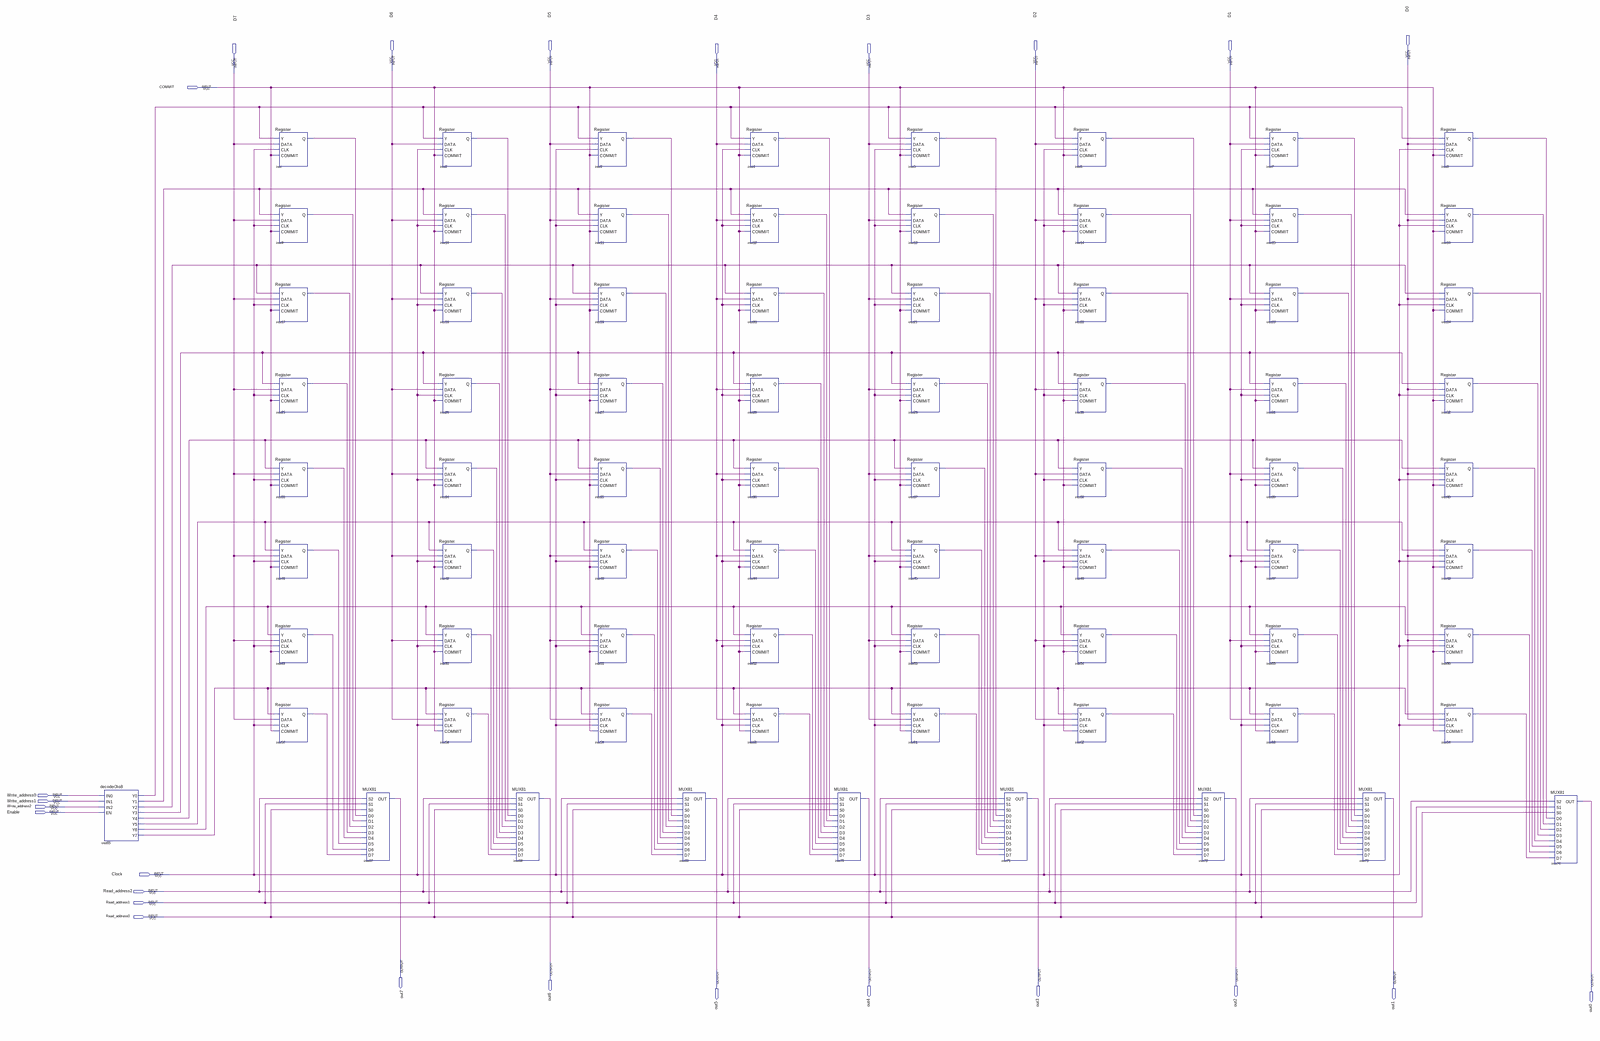
[diagram p0: schematic sheet, whole]
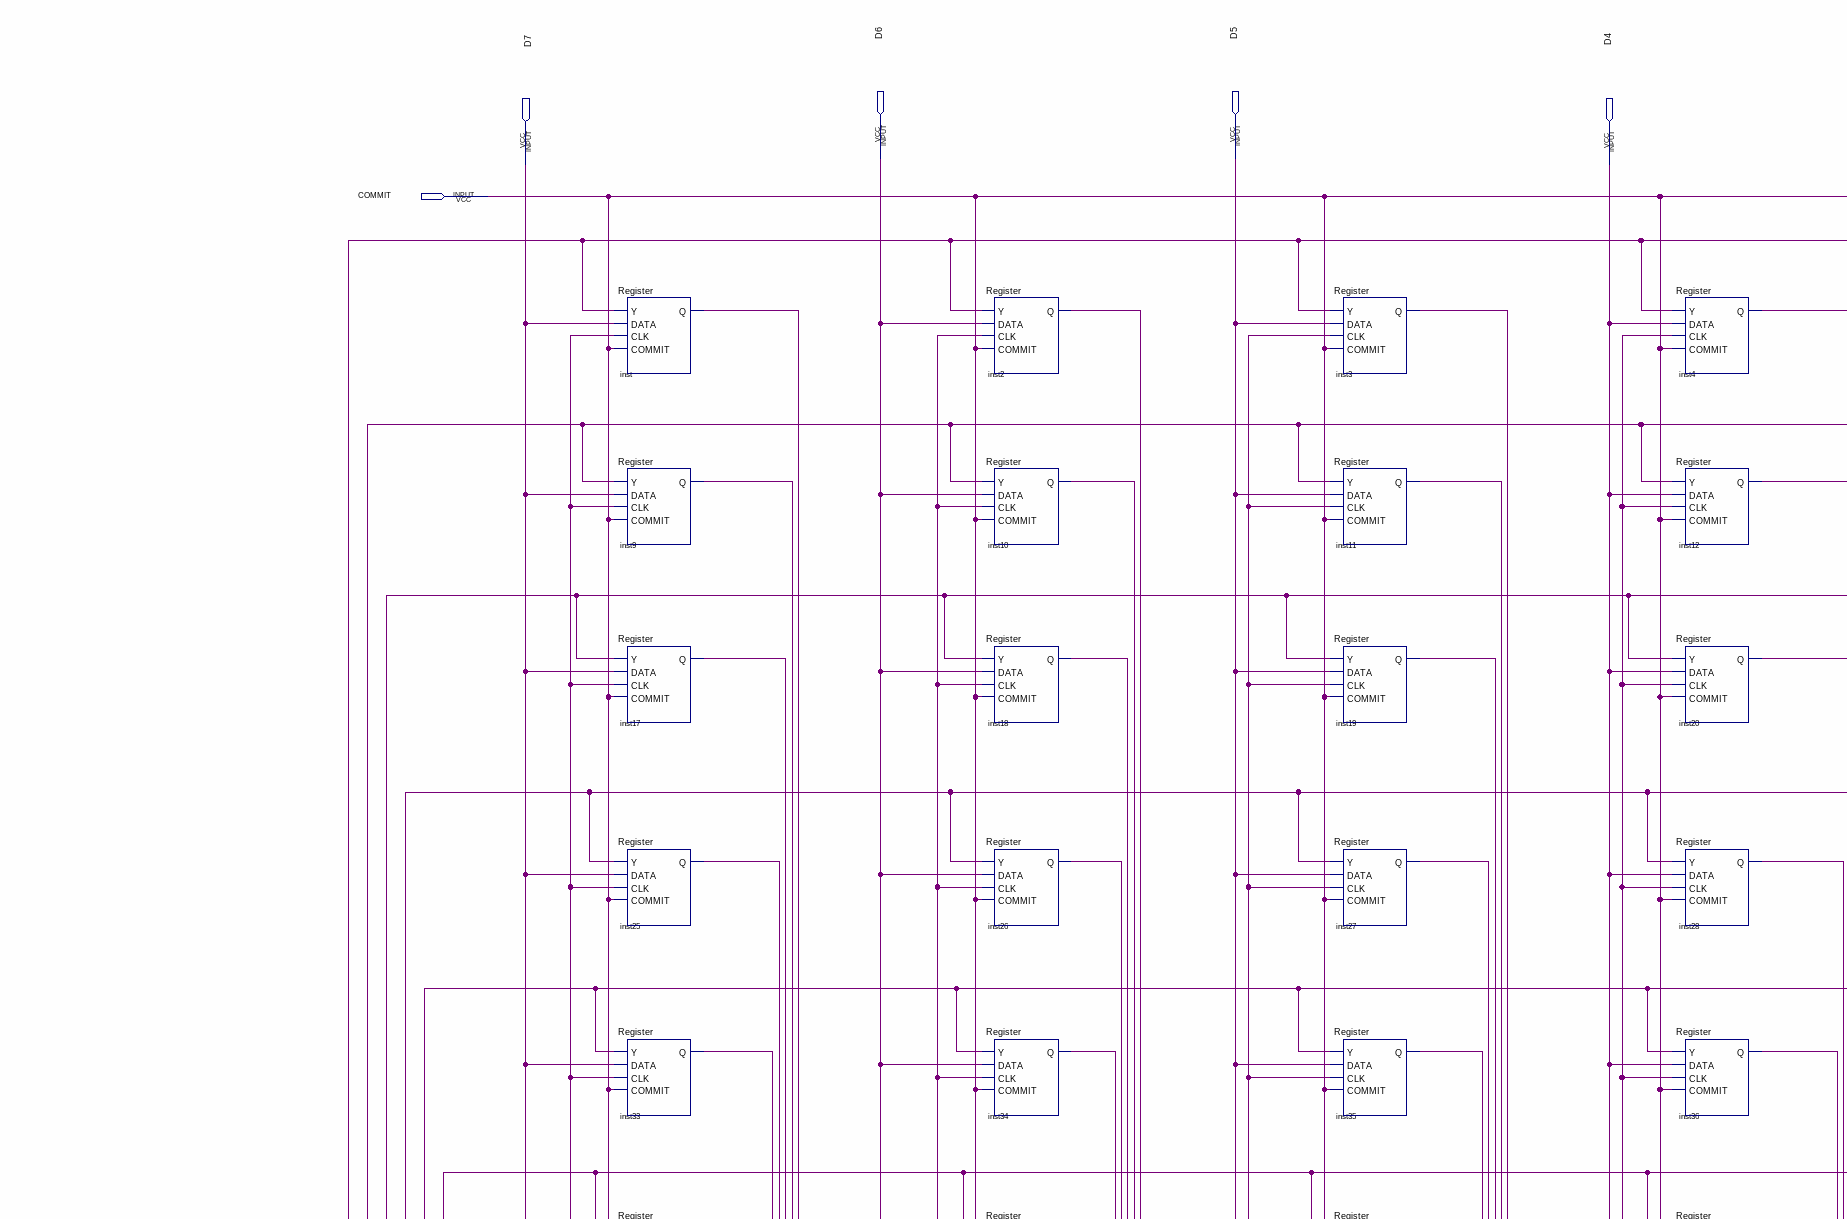
[diagram p1: schematic sheet, upper left part]
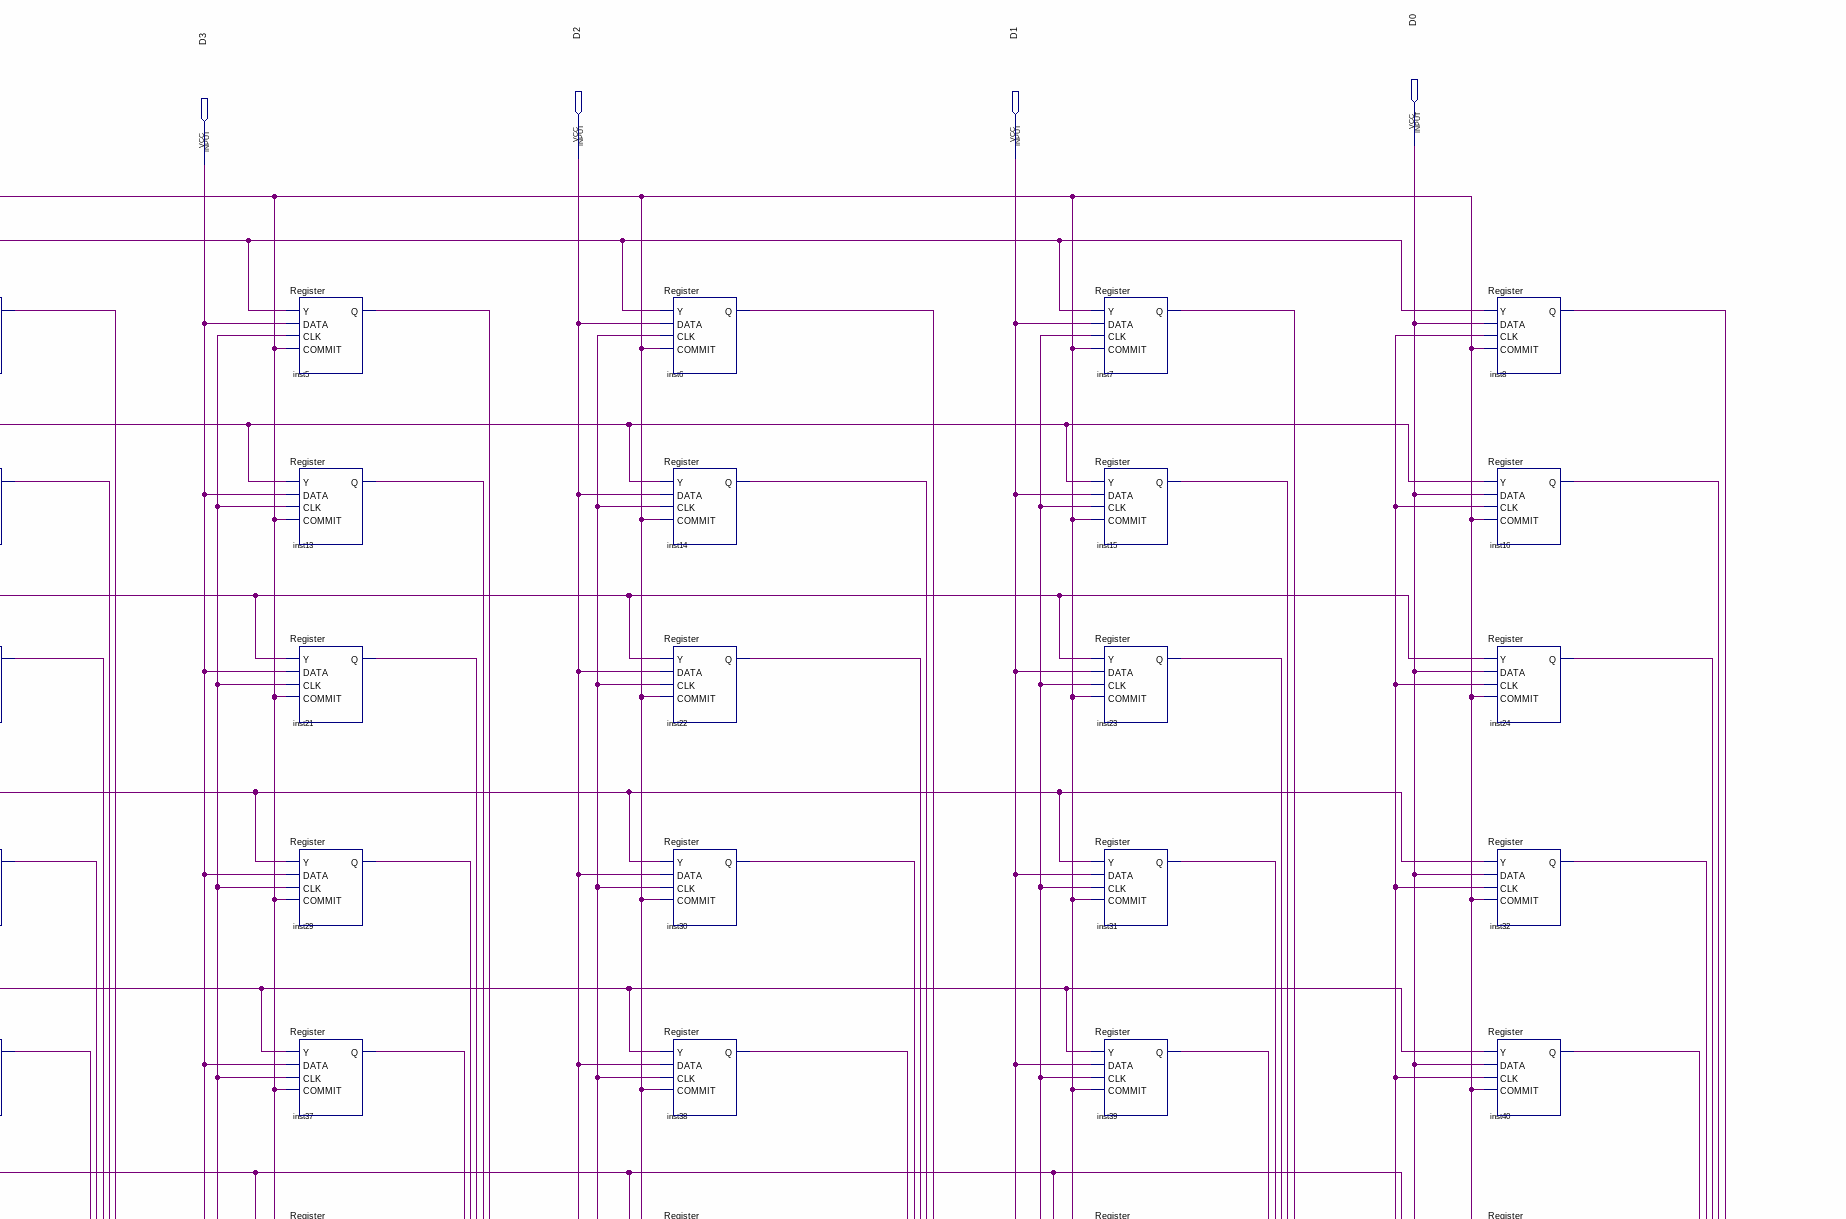
[diagram p2: schematic sheet, upper right part]
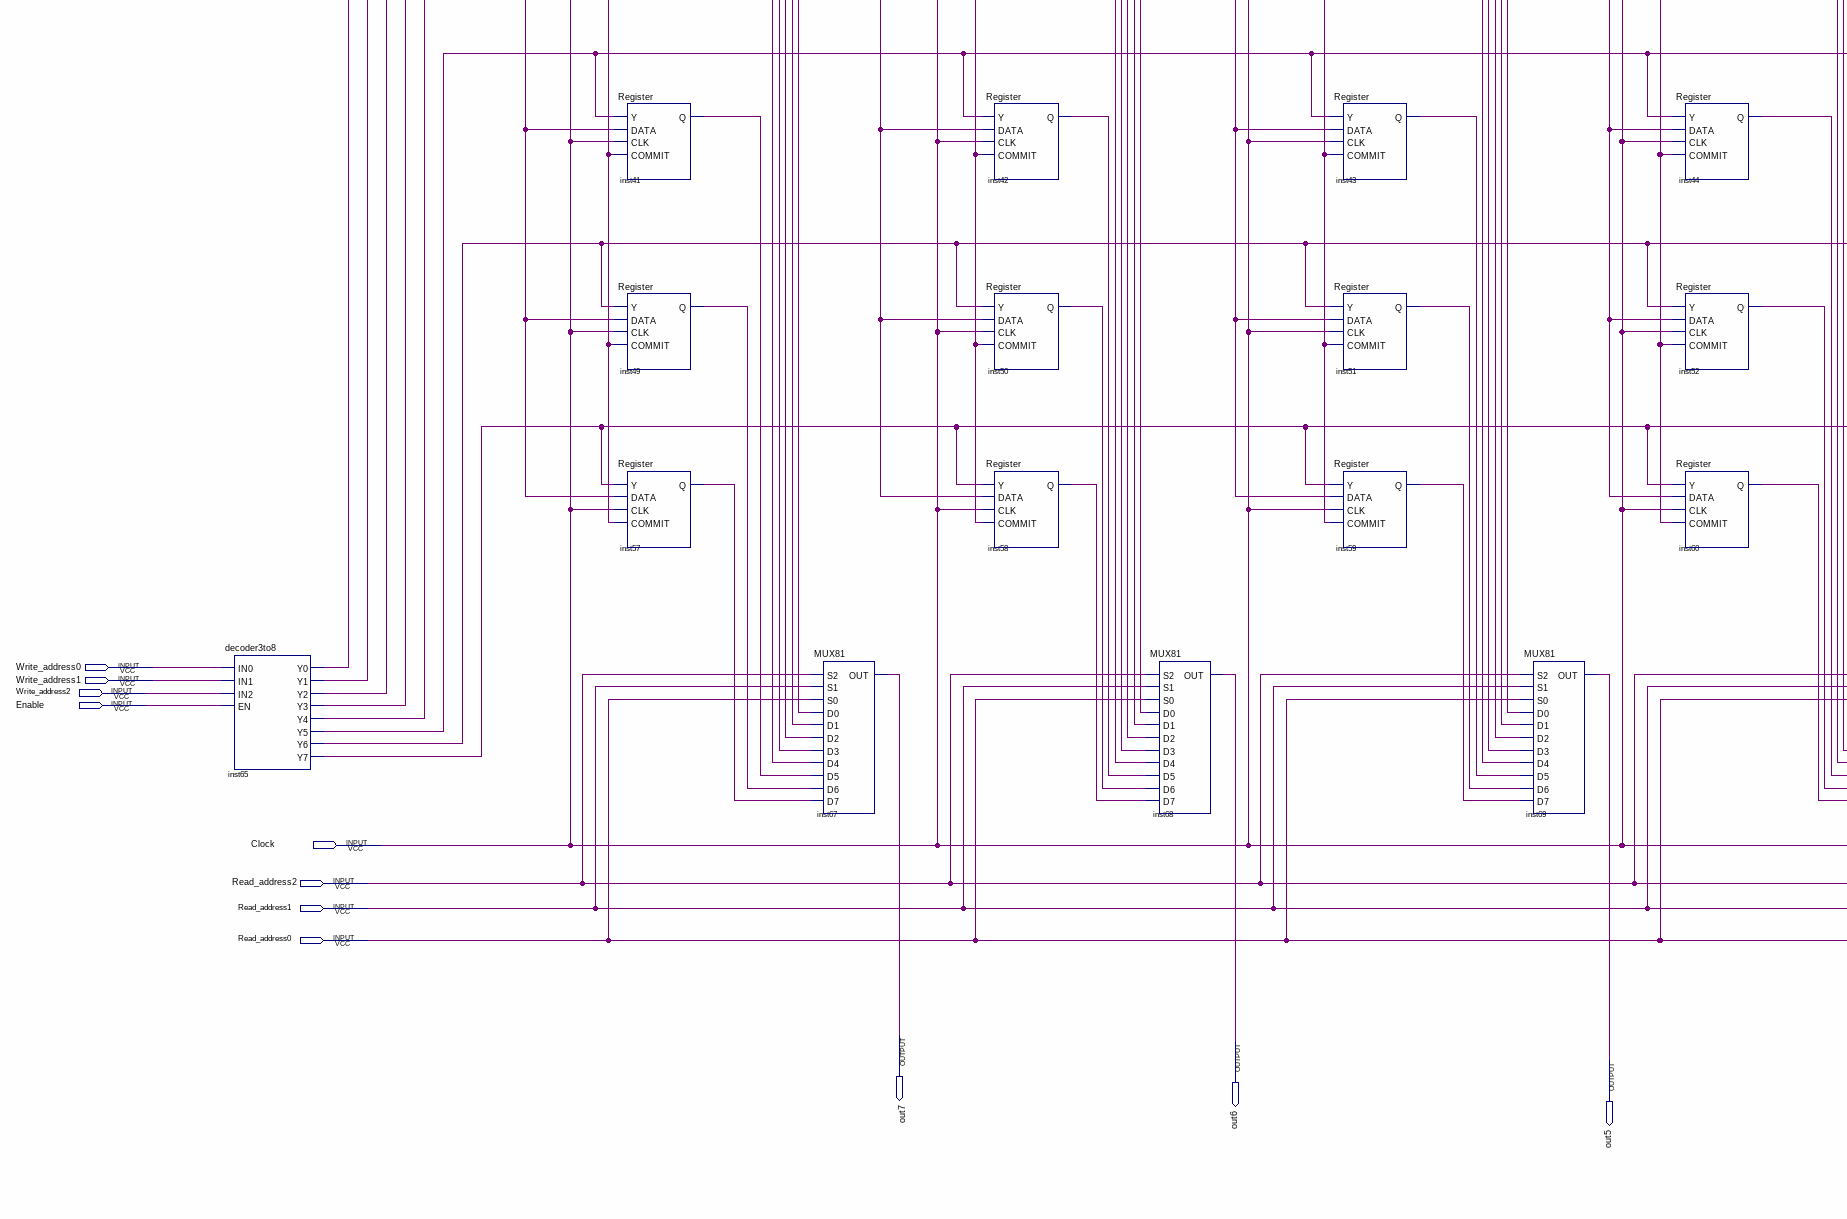
[diagram p3: schematic sheet, lower left part]
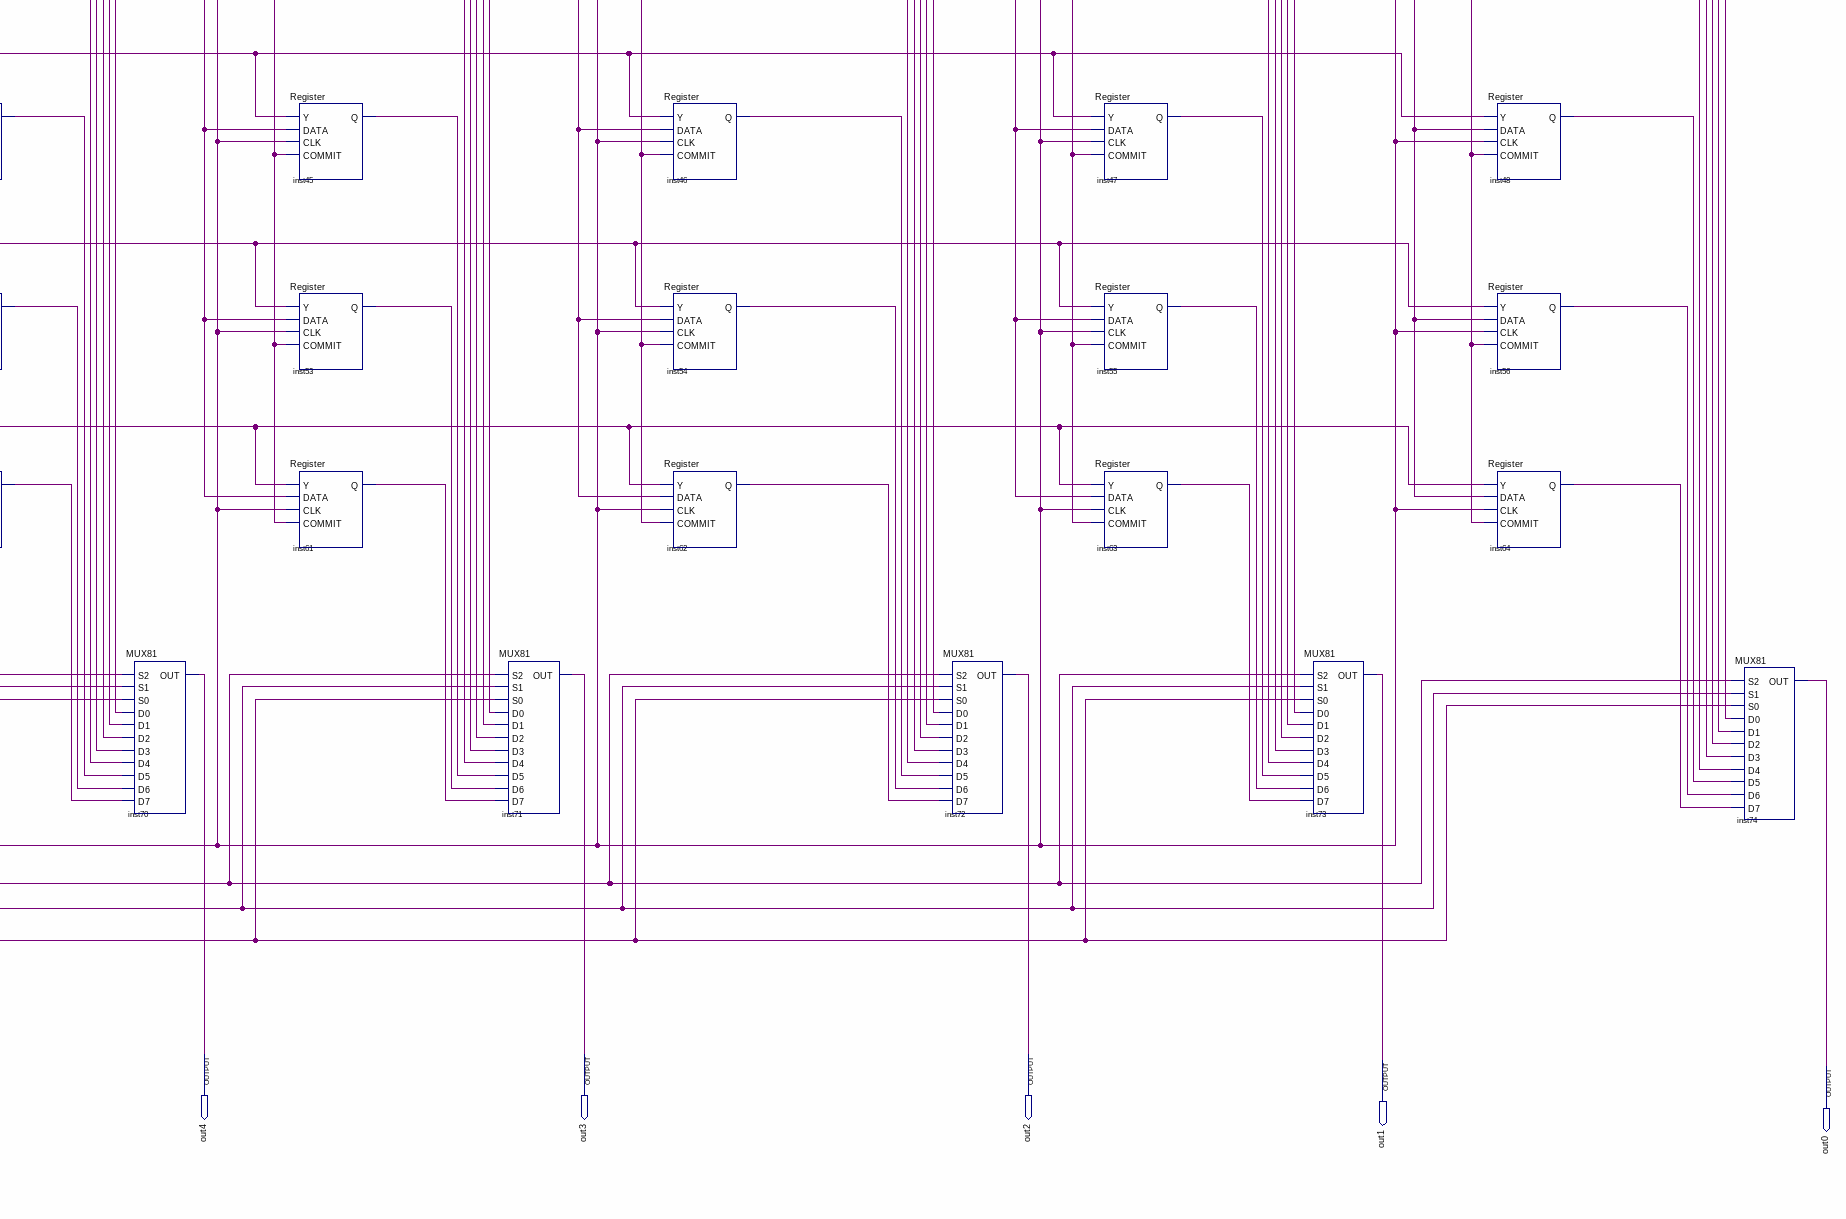
[diagram p4: schematic sheet, lower right part]
// Quartus schematic File.bdf as structural Verilog: 73 symbols, 25 pins
module File (
  input  D0,
  input  D6,
  input  D5,
  input  D2,
  input  D1,
  input  D7,
  input  D4,
  input  D3,
  input  COMMIT,
  input  Write_address0,
  input  Write_address1,
  input  Write_address2,
  input  Enable,
  input  Clock,
  input  Read_address2,
  input  Read_address1,
  input  Read_address0,
  output out7,
  output out6,
  output out4,
  output out3,
  output out2,
  output out5,
  output out1,
  output out0
);

  wire inst2_q, inst3_q, inst4_q, inst5_q, inst6_q, inst7_q, inst8_q, inst9_q, inst10_q, inst11_q, inst12_q,
       inst13_q, inst14_q, inst15_q, inst16_q, inst17_q, inst18_q, inst19_q, inst20_q, inst21_q, inst22_q,
       inst23_q, inst24_q, inst25_q, inst26_q, inst27_q, inst28_q, inst29_q, inst30_q, inst31_q, inst32_q,
       inst33_q, inst34_q, inst35_q, inst36_q, inst37_q, inst38_q, inst39_q, inst40_q, inst41_q, inst42_q,
       inst43_q, inst44_q, inst45_q, inst46_q, inst47_q, inst48_q, inst49_q, inst50_q, inst51_q, inst52_q,
       inst53_q, inst54_q, inst55_q, inst56_q, inst57_q, inst58_q, inst59_q, inst60_q, inst61_q, inst62_q,
       inst63_q, inst64_q, inst65_y0, inst65_y1, inst65_y2, inst65_y3, inst65_y4, inst65_y5, inst65_y6,
       inst65_y7, inst_q;

  decoder3to8 inst65 (
    .IN0(Write_address0), .IN1(Write_address1), .IN2(Write_address2), .EN(Enable), .Y0(inst65_y0),
    .Y1(inst65_y1), .Y2(inst65_y2), .Y3(inst65_y3), .Y4(inst65_y4), .Y5(inst65_y5), .Y6(inst65_y6),
    .Y7(inst65_y7));
  Register inst (.Y(inst65_y0), .DATA(D7), .CLK(Clock), .COMMIT(COMMIT), .Q(inst_q));
  Register inst9 (.Y(inst65_y1), .DATA(D7), .CLK(Clock), .COMMIT(COMMIT), .Q(inst9_q));
  Register inst17 (.Y(inst65_y2), .DATA(D7), .CLK(Clock), .COMMIT(COMMIT), .Q(inst17_q));
  Register inst25 (.Y(inst65_y3), .DATA(D7), .CLK(Clock), .COMMIT(COMMIT), .Q(inst25_q));
  Register inst33 (.Y(inst65_y4), .DATA(D7), .CLK(Clock), .COMMIT(COMMIT), .Q(inst33_q));
  Register inst41 (.Y(inst65_y5), .DATA(D7), .CLK(Clock), .COMMIT(COMMIT), .Q(inst41_q));
  Register inst49 (.Y(inst65_y6), .DATA(D7), .CLK(Clock), .COMMIT(COMMIT), .Q(inst49_q));
  Register inst57 (.Y(inst65_y7), .DATA(D7), .CLK(Clock), .COMMIT(COMMIT), .Q(inst57_q));
  MUX81 inst67 (
    .S2(Read_address2), .S1(Read_address1), .S0(Read_address0), .D0(inst_q), .D1(inst9_q), .D2(inst17_q),
    .D3(inst25_q), .D4(inst33_q), .D5(inst41_q), .D6(inst49_q), .D7(inst57_q), .OUT(out7));
  Register inst2 (.Y(inst65_y0), .DATA(D6), .CLK(Clock), .COMMIT(COMMIT), .Q(inst2_q));
  Register inst10 (.Y(inst65_y1), .DATA(D6), .CLK(Clock), .COMMIT(COMMIT), .Q(inst10_q));
  Register inst18 (.Y(inst65_y2), .DATA(D6), .CLK(Clock), .COMMIT(COMMIT), .Q(inst18_q));
  Register inst26 (.Y(inst65_y3), .DATA(D6), .CLK(Clock), .COMMIT(COMMIT), .Q(inst26_q));
  Register inst34 (.Y(inst65_y4), .DATA(D6), .CLK(Clock), .COMMIT(COMMIT), .Q(inst34_q));
  Register inst42 (.Y(inst65_y5), .DATA(D6), .CLK(Clock), .COMMIT(COMMIT), .Q(inst42_q));
  Register inst50 (.Y(inst65_y6), .DATA(D6), .CLK(Clock), .COMMIT(COMMIT), .Q(inst50_q));
  Register inst58 (.Y(inst65_y7), .DATA(D6), .CLK(Clock), .COMMIT(COMMIT), .Q(inst58_q));
  MUX81 inst68 (
    .S2(Read_address2), .S1(Read_address1), .S0(Read_address0), .D0(inst2_q), .D1(inst10_q), .D2(inst18_q),
    .D3(inst26_q), .D4(inst34_q), .D5(inst42_q), .D6(inst50_q), .D7(inst58_q), .OUT(out6));
  Register inst3 (.Y(inst65_y0), .DATA(D5), .CLK(Clock), .COMMIT(COMMIT), .Q(inst3_q));
  Register inst11 (.Y(inst65_y1), .DATA(D5), .CLK(Clock), .COMMIT(COMMIT), .Q(inst11_q));
  Register inst19 (.Y(inst65_y2), .DATA(D5), .CLK(Clock), .COMMIT(COMMIT), .Q(inst19_q));
  Register inst27 (.Y(inst65_y3), .DATA(D5), .CLK(Clock), .COMMIT(COMMIT), .Q(inst27_q));
  Register inst35 (.Y(inst65_y4), .DATA(D5), .CLK(Clock), .COMMIT(COMMIT), .Q(inst35_q));
  Register inst43 (.Y(inst65_y5), .DATA(D5), .CLK(Clock), .COMMIT(COMMIT), .Q(inst43_q));
  Register inst51 (.Y(inst65_y6), .DATA(D5), .CLK(Clock), .COMMIT(COMMIT), .Q(inst51_q));
  Register inst59 (.Y(inst65_y7), .DATA(D5), .CLK(Clock), .COMMIT(COMMIT), .Q(inst59_q));
  MUX81 inst69 (
    .S2(Read_address2), .S1(Read_address1), .S0(Read_address0), .D0(inst3_q), .D1(inst11_q), .D2(inst19_q),
    .D3(inst27_q), .D4(inst35_q), .D5(inst43_q), .D6(inst51_q), .D7(inst59_q), .OUT(out5));
  Register inst4 (.Y(inst65_y0), .DATA(D4), .CLK(Clock), .COMMIT(COMMIT), .Q(inst4_q));
  Register inst12 (.Y(inst65_y1), .DATA(D4), .CLK(Clock), .COMMIT(COMMIT), .Q(inst12_q));
  Register inst20 (.Y(inst65_y2), .DATA(D4), .CLK(Clock), .COMMIT(COMMIT), .Q(inst20_q));
  Register inst28 (.Y(inst65_y3), .DATA(D4), .CLK(Clock), .COMMIT(COMMIT), .Q(inst28_q));
  Register inst36 (.Y(inst65_y4), .DATA(D4), .CLK(Clock), .COMMIT(COMMIT), .Q(inst36_q));
  Register inst44 (.Y(inst65_y5), .DATA(D4), .CLK(Clock), .COMMIT(COMMIT), .Q(inst44_q));
  Register inst52 (.Y(inst65_y6), .DATA(D4), .CLK(Clock), .COMMIT(COMMIT), .Q(inst52_q));
  Register inst60 (.Y(inst65_y7), .DATA(D4), .CLK(Clock), .COMMIT(COMMIT), .Q(inst60_q));
  MUX81 inst70 (
    .S2(Read_address2), .S1(Read_address1), .S0(Read_address0), .D0(inst4_q), .D1(inst12_q), .D2(inst20_q),
    .D3(inst28_q), .D4(inst36_q), .D5(inst44_q), .D6(inst52_q), .D7(inst60_q), .OUT(out4));
  Register inst5 (.Y(inst65_y0), .DATA(D3), .CLK(Clock), .COMMIT(COMMIT), .Q(inst5_q));
  Register inst13 (.Y(inst65_y1), .DATA(D3), .CLK(Clock), .COMMIT(COMMIT), .Q(inst13_q));
  Register inst21 (.Y(inst65_y2), .DATA(D3), .CLK(Clock), .COMMIT(COMMIT), .Q(inst21_q));
  Register inst29 (.Y(inst65_y3), .DATA(D3), .CLK(Clock), .COMMIT(COMMIT), .Q(inst29_q));
  Register inst37 (.Y(inst65_y4), .DATA(D3), .CLK(Clock), .COMMIT(COMMIT), .Q(inst37_q));
  Register inst45 (.Y(inst65_y5), .DATA(D3), .CLK(Clock), .COMMIT(COMMIT), .Q(inst45_q));
  Register inst53 (.Y(inst65_y6), .DATA(D3), .CLK(Clock), .COMMIT(COMMIT), .Q(inst53_q));
  Register inst61 (.Y(inst65_y7), .DATA(D3), .CLK(Clock), .COMMIT(COMMIT), .Q(inst61_q));
  MUX81 inst71 (
    .S2(Read_address2), .S1(Read_address1), .S0(Read_address0), .D0(inst5_q), .D1(inst13_q), .D2(inst21_q),
    .D3(inst29_q), .D4(inst37_q), .D5(inst45_q), .D6(inst53_q), .D7(inst61_q), .OUT(out3));
  Register inst6 (.Y(inst65_y0), .DATA(D2), .CLK(Clock), .COMMIT(COMMIT), .Q(inst6_q));
  Register inst14 (.Y(inst65_y1), .DATA(D2), .CLK(Clock), .COMMIT(COMMIT), .Q(inst14_q));
  Register inst22 (.Y(inst65_y2), .DATA(D2), .CLK(Clock), .COMMIT(COMMIT), .Q(inst22_q));
  Register inst30 (.Y(inst65_y3), .DATA(D2), .CLK(Clock), .COMMIT(COMMIT), .Q(inst30_q));
  Register inst38 (.Y(inst65_y4), .DATA(D2), .CLK(Clock), .COMMIT(COMMIT), .Q(inst38_q));
  Register inst46 (.Y(inst65_y5), .DATA(D2), .CLK(Clock), .COMMIT(COMMIT), .Q(inst46_q));
  Register inst54 (.Y(inst65_y6), .DATA(D2), .CLK(Clock), .COMMIT(COMMIT), .Q(inst54_q));
  Register inst62 (.Y(inst65_y7), .DATA(D2), .CLK(Clock), .COMMIT(COMMIT), .Q(inst62_q));
  MUX81 inst72 (
    .S2(Read_address2), .S1(Read_address1), .S0(Read_address0), .D0(inst6_q), .D1(inst14_q), .D2(inst22_q),
    .D3(inst30_q), .D4(inst38_q), .D5(inst46_q), .D6(inst54_q), .D7(inst62_q), .OUT(out2));
  Register inst7 (.Y(inst65_y0), .DATA(D1), .CLK(Clock), .COMMIT(COMMIT), .Q(inst7_q));
  Register inst15 (.Y(inst65_y1), .DATA(D1), .CLK(Clock), .COMMIT(COMMIT), .Q(inst15_q));
  Register inst23 (.Y(inst65_y2), .DATA(D1), .CLK(Clock), .COMMIT(COMMIT), .Q(inst23_q));
  Register inst31 (.Y(inst65_y3), .DATA(D1), .CLK(Clock), .COMMIT(COMMIT), .Q(inst31_q));
  Register inst39 (.Y(inst65_y4), .DATA(D1), .CLK(Clock), .COMMIT(COMMIT), .Q(inst39_q));
  Register inst47 (.Y(inst65_y5), .DATA(D1), .CLK(Clock), .COMMIT(COMMIT), .Q(inst47_q));
  Register inst55 (.Y(inst65_y6), .DATA(D1), .CLK(Clock), .COMMIT(COMMIT), .Q(inst55_q));
  Register inst63 (.Y(inst65_y7), .DATA(D1), .CLK(Clock), .COMMIT(COMMIT), .Q(inst63_q));
  MUX81 inst73 (
    .S2(Read_address2), .S1(Read_address1), .S0(Read_address0), .D0(inst7_q), .D1(inst15_q), .D2(inst23_q),
    .D3(inst31_q), .D4(inst39_q), .D5(inst47_q), .D6(inst55_q), .D7(inst63_q), .OUT(out1));
  Register inst8 (.Y(inst65_y0), .DATA(D0), .CLK(Clock), .COMMIT(COMMIT), .Q(inst8_q));
  Register inst16 (.Y(inst65_y1), .DATA(D0), .CLK(Clock), .COMMIT(COMMIT), .Q(inst16_q));
  Register inst24 (.Y(inst65_y2), .DATA(D0), .CLK(Clock), .COMMIT(COMMIT), .Q(inst24_q));
  Register inst32 (.Y(inst65_y3), .DATA(D0), .CLK(Clock), .COMMIT(COMMIT), .Q(inst32_q));
  Register inst40 (.Y(inst65_y4), .DATA(D0), .CLK(Clock), .COMMIT(COMMIT), .Q(inst40_q));
  Register inst48 (.Y(inst65_y5), .DATA(D0), .CLK(Clock), .COMMIT(COMMIT), .Q(inst48_q));
  Register inst56 (.Y(inst65_y6), .DATA(D0), .CLK(Clock), .COMMIT(COMMIT), .Q(inst56_q));
  Register inst64 (.Y(inst65_y7), .DATA(D0), .CLK(Clock), .COMMIT(COMMIT), .Q(inst64_q));
  MUX81 inst74 (
    .S2(Read_address2), .S1(Read_address1), .S0(Read_address0), .D0(inst8_q), .D1(inst16_q), .D2(inst24_q),
    .D3(inst32_q), .D4(inst40_q), .D5(inst48_q), .D6(inst56_q), .D7(inst64_q), .OUT(out0));
endmodule
